# EAGLE schematic AeroQuad (EAGLE 5.06)
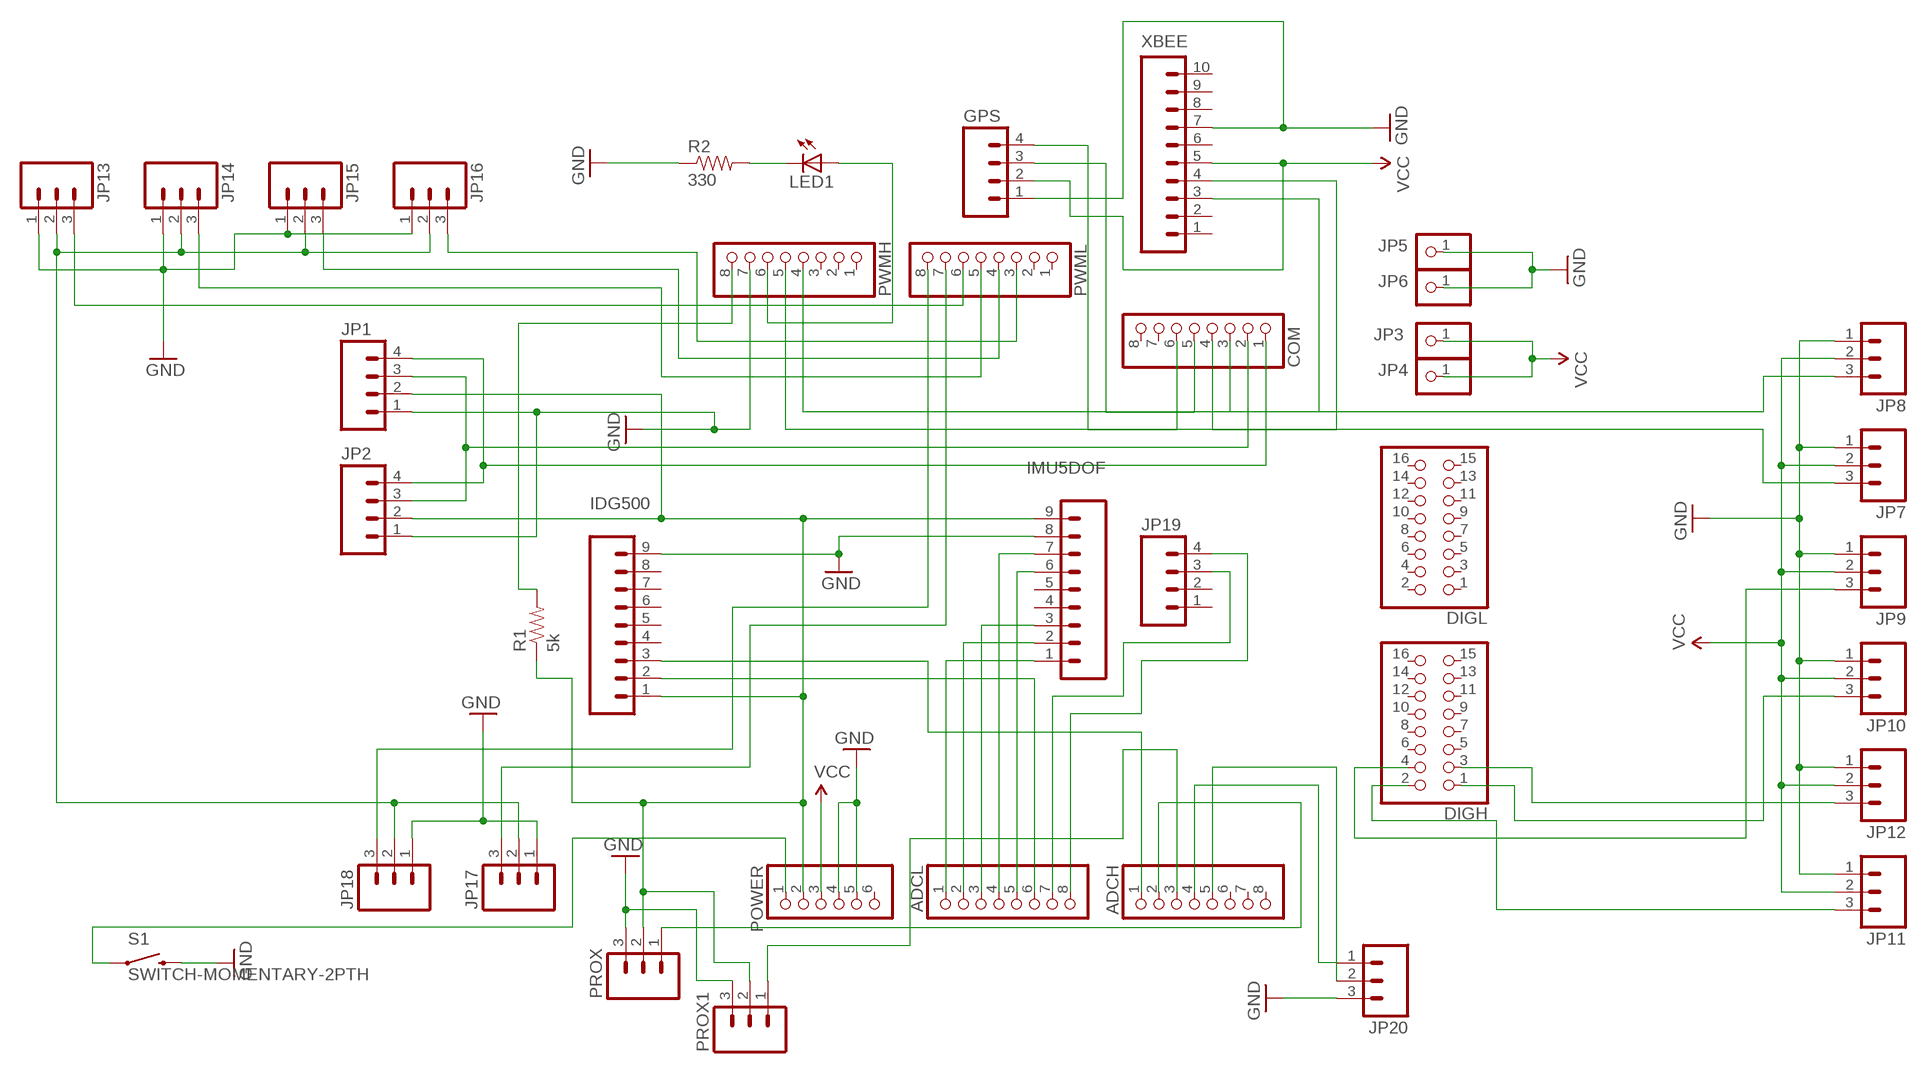
[diagram p0: schematic, sheet 1]

## Parts
ADCH  PINHD-1X8  [1X08]
ADCL  PINHD-1X8  [1X08]
COM  PINHD-1X8  [1X08]
DIGH  PINHD-2X8  [2X08]
DIGL  PINHD-2X8  [2X08]
GPS  M04PTH  [1X04]
IDG500  M09LOCK  [1X09_LOCK]
IMU5DOF  M09LOCK  [1X09_LOCK]
JP1  M04LOCK  [1X04_LOCK]
JP2  M04LOCK  [1X04_LOCK]
JP3  PINHD-1X1  [1X01]
JP4  PINHD-1X1  [1X01]
JP5  PINHD-1X1  [1X01]
JP6  PINHD-1X1  [1X01]
JP7  M03LOCK  [1X03_LOCK]
JP8  M03LOCK  [1X03_LOCK]
JP9  M03LOCK  [1X03_LOCK]
JP10  M03LOCK  [1X03_LOCK]
JP11  M03LOCK  [1X03_LOCK]
JP12  M03LOCK  [1X03_LOCK]
JP13  M03LOCK  [1X03_LOCK]
JP14  M03LOCK  [1X03_LOCK]
JP15  M03LOCK  [1X03_LOCK]
JP16  M03LOCK  [1X03_LOCK]
JP17  M03LOCK  [1X03_LOCK]
JP18  M03LOCK  [1X03_LOCK]
JP19  M04PTH  [1X04]
JP20  M03PTH  [1X03]
LED1  LED5MM  [LED5MM]
POWER  PINHD-1X6  [1X06]
PROX  M03PTH  [1X03]
PROX1  M03PTH  [1X03]
PWMH  PINHD-1X8  [1X08]
PWML  PINHD-1X8  [1X08]
R1  5k  RESISTORPTH1  [AXIAL-0.3]
R2  330  RESISTORPTH1  [AXIAL-0.3]
S1  SWITCH-MOMENTARY-2PTH  [TACTILE-PTH]
XBEE  M10LOCK  [1X10_LOCK]

## Nets
GND [gnd]: GPS.1 IDG500.9 IMU5DOF.8 JP1.1 JP2.1 JP5.1 JP6.1 JP7.1 JP8.1 JP9.1 JP10.1 JP11.1 JP12.1 JP13.1 JP14.1 JP15.1 JP16.1 JP17.1 JP18.1 JP20.3 POWER.4 POWER.5 PROX1.3 PROX.3 PWMH.7 R2.P$1 S1.3 XBEE.7
N$4: POWER.1 S1.1
N$5: ADCH.5 JP20.2
N$6: ADCH.4 JP20.1
N$7: ADCH.2 PROX.1
N$8: ADCH.1 IDG500.3
N$9: ADCL.8 JP19.4
N$10: ADCL.7 JP19.3
N$11: ADCL.6 IDG500.2
N$12: ADCL.5 IMU5DOF.6
N$13: ADCL.4 IMU5DOF.7
N$14: ADCL.3 IMU5DOF.3
N$15: ADCL.2 IMU5DOF.2
N$16: ADCL.1 IMU5DOF.1
N$40: DIGH.3 JP12.3
N$41: DIGH.1 JP10.3
N$42: JP7.3 PWMH.5
N$43: JP8.3 PWMH.4
N$51: IDG500.1 IMU5DOF.9 JP1.2 JP2.2 POWER.2 PROX1.2 PROX.2 R1.P$1
N$52: COM.4 XBEE.4
N$53: JP16.3 PWML.3
N$54: JP15.3 PWML.4
N$56: JP14.3 PWML.5
N$57: JP13.3 PWML.6
N$58: JP17.3 PWML.7
N$59: DIGH.2 JP11.3
N$60: JP18.3 PWML.8
N$61: DIGH.4 JP9.3
N$62: PWMH.8 R1.P$2
N$63: LED1.K(C) R2.P$2
N$65: JP13.2 JP14.2 JP15.2 JP16.2 JP17.2 JP18.2
N$66: LED1.A PWMH.6
N$70: COM.6 GPS.4
N$73: COM.5 GPS.3
N$74: ADCH.3 PROX1.1
N$75: COM.3 XBEE.3
N$76: COM.2 JP1.3 JP2.3
N$77: COM.1 JP1.4 JP2.4
VCC [power]: GPS.2 JP3.1 JP4.1 JP7.2 JP8.2 JP9.2 JP10.2 JP11.2 JP12.2 POWER.3 XBEE.5
Unconnected: ADCH.6 ADCH.7 ADCH.8 COM.7 COM.8 DIGH.5 DIGH.6 DIGH.7 DIGH.8 DIGH.9 DIGH.10 DIGH.11 DIGH.12 DIGH.13 DIGH.14 DIGH.15 DIGH.16 DIGL.1 DIGL.2 DIGL.3 DIGL.4 DIGL.5 DIGL.6 DIGL.7 DIGL.8 DIGL.9 DIGL.10 DIGL.11 DIGL.12 DIGL.13 DIGL.14 DIGL.15 DIGL.16 IDG500.4 IDG500.5 IDG500.6 IDG500.7 IDG500.8 IMU5DOF.4 IMU5DOF.5 JP19.1 JP19.2 POWER.6 PWMH.1 PWMH.2 PWMH.3 PWML.1 PWML.2 XBEE.1 XBEE.2 XBEE.6 XBEE.8 XBEE.9 XBEE.10

## Library data of the parts
ADCH ADCL COM PWMH PWML = pinhead:PINHD-1X8: PIN HEADER
DIGH DIGL = pinhead:PINHD-2X8: PIN HEADER
GPS JP1 JP2 JP19 = SparkFun:M04: Header 4 Standard 4-pin 0.1" header. Use with straight break away headers (SKU : PRT-00116), right angle break away headers (PRT-00553), swiss pins (PRT-00743), machine pins (PRT-00117), and female headers (PRT-00115). Molex polarized connector foot print use with SKU : PRT-08231 with associated crimp pins and housings.
IDG500 IMU5DOF = SparkFun:M09: Header 9 Standard 9-pin 0.1" header. Use with straight break away headers (SKU : PRT-00116), right angle break away headers (PRT-00553), swiss pins (PRT-00743), machine pins (PRT-00117), and female headers (PRT-00115).
JP3-JP6 = pinhead:PINHD-1X1: PIN HEADER
JP7-JP18 JP20 PROX PROX1 = SparkFun:M03: Header 3 Standard 3-pin 0.1" header. Use with straight break away headers (SKU : PRT-00116), right angle break away headers (PRT-00553), swiss pins (PRT-00743), machine pins (PRT-00117), and female headers (PRT-00115). Molex polarized connector foot print use with SKU : PRT-08232 with associated crimp pins and housings.
LED1 = SparkFun:LED: LEDs Standard schematic elements and footprints for 5mm, 3mm, 1206, and 0603 sized LEDs. 5mm - Spark Fun Electronics SKU : COM-00529 (and others)
POWER = pinhead:PINHD-1X6: PIN HEADER
R1 R2 = SparkFun:RESISTOR: Resistor Basic schematic elements and footprints for 0603, 1206, and PTH 1/10th watt (small) resistors.
S1 = SparkFun:SWITCH-MOMENTARY-2
XBEE = SparkFun:M10: Header 10 Standard 10-pin 0.1" header. Use with straight break away headers (SKU : PRT-00116), right angle break away headers (PRT-00553), swiss pins (PRT-00743), machine pins (PRT-00117), and female headers (PRT-00115).

## Net classes
0 default: width 0.203 mm, drill 0.406 mm, clearance 0.203 mm
1 power: width 0.61 mm, drill 0.711 mm, clearance 0.203 mm
2 gnd: width 0.305 mm, drill 0.711 mm, clearance 0.203 mm
3 usbvcc: width 0.508 mm, drill 0.711 mm, clearance 0.203 mm